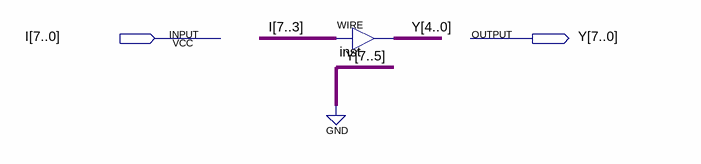
[diagram p0: schematic sheet]
// Quartus schematic SHIFTR3bit.bdf as structural Verilog: 1 symbols, 2 pins
module SHIFTR3bit (
  input  [7:0] I,
  output [7:0] Y
);

  assign Y[4:0] = I[7:3];  // WIRE inst

  assign Y[7:5] = 3'b000;
endmodule
